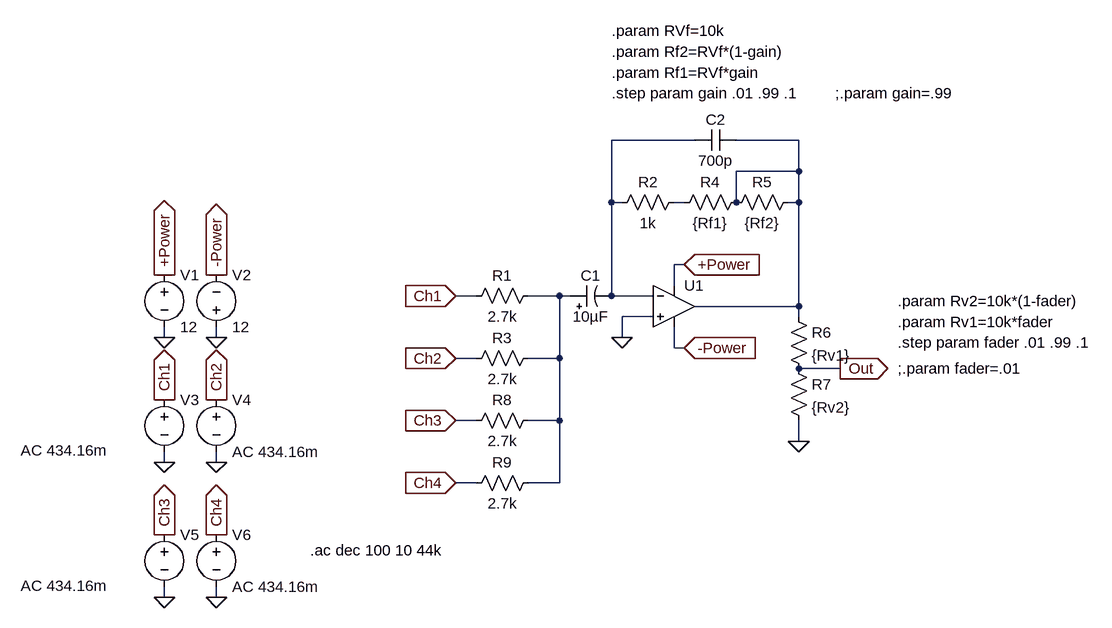
[diagram p0: schematic Master Mixer Freq.asc]
Master Mixer Freq.asc, the LTspice schematic file:
Version 4.1
SHEET 1 924 680
WIRE 256 -128 128 -128
WIRE 416 -128 320 -128
WIRE 416 -80 416 -128
WIRE 416 -80 320 -80
WIRE 128 -32 128 -128
WIRE 144 -32 128 -32
WIRE 240 -32 224 -32
WIRE 320 -32 320 -80
WIRE 416 -32 416 -80
WIRE 416 -32 400 -32
WIRE 240 64 224 64
WIRE 224 96 224 64
WIRE -80 112 -112 112
WIRE 48 112 0 112
WIRE 64 112 48 112
WIRE 128 112 128 -32
WIRE 192 112 128 112
WIRE 416 128 416 -32
WIRE 416 128 256 128
WIRE 192 144 144 144
WIRE 416 144 416 128
WIRE -560 176 -560 160
WIRE -480 176 -480 160
WIRE 144 176 144 144
WIRE 224 192 224 160
WIRE 240 192 224 192
WIRE -80 208 -112 208
WIRE 48 208 48 112
WIRE 48 208 0 208
WIRE 480 224 416 224
WIRE -80 304 -112 304
WIRE 48 304 48 208
WIRE 48 304 0 304
WIRE 416 336 416 304
WIRE -560 368 -560 352
WIRE -480 368 -480 352
WIRE -80 400 -112 400
WIRE 48 400 48 304
WIRE 48 400 0 400
WIRE -560 576 -560 560
WIRE -480 576 -480 560
FLAG 240 64 +Power
IOPIN 240 64 In
FLAG 240 192 -Power
IOPIN 240 192 In
FLAG 144 176 0
FLAG 416 336 0
FLAG -112 112 Ch1
IOPIN -112 112 In
FLAG -112 208 Ch2
IOPIN -112 208 In
FLAG 480 224 Out
IOPIN 480 224 Out
FLAG -560 80 +Power
IOPIN -560 80 Out
FLAG -560 176 0
FLAG -480 176 0
FLAG -560 368 0
FLAG -480 80 -Power
IOPIN -480 80 Out
FLAG -560 272 Ch1
IOPIN -560 272 Out
FLAG -480 368 0
FLAG -480 272 Ch2
IOPIN -480 272 Out
FLAG -112 304 Ch3
IOPIN -112 304 In
FLAG -112 400 Ch4
IOPIN -112 400 In
FLAG -560 576 0
FLAG -560 480 Ch3
IOPIN -560 480 Out
FLAG -480 576 0
FLAG -480 480 Ch4
IOPIN -480 480 Out
SYMBOL res 16 96 R90
WINDOW 0 0 56 VBottom 2
WINDOW 3 32 56 VTop 2
SYMATTR InstName R1
SYMATTR Value 2.7k
SYMBOL OpAmps\\UniversalOpAmp 224 128 R0
SYMATTR InstName U1
SYMBOL res 240 -48 R90
WINDOW 0 0 56 VBottom 2
WINDOW 3 32 56 VTop 2
SYMATTR InstName R2
SYMATTR Value 1k
SYMBOL res 16 192 R90
WINDOW 0 0 56 VBottom 2
WINDOW 3 32 56 VTop 2
SYMATTR InstName R3
SYMATTR Value 2.7k
SYMBOL voltage -560 64 R0
WINDOW 123 0 0 Left 0
WINDOW 39 0 0 Left 0
SYMATTR InstName V1
SYMATTR Value 12
SYMBOL voltage -480 176 M180
WINDOW 0 24 96 Left 2
WINDOW 3 24 16 Left 2
WINDOW 123 0 0 Left 0
WINDOW 39 0 0 Left 0
SYMATTR InstName V2
SYMATTR Value 12
SYMBOL voltage -560 256 R0
WINDOW 3 -221 94 Left 2
WINDOW 123 0 0 Left 0
WINDOW 39 0 0 Left 0
SYMATTR Value AC 434.16m
SYMATTR InstName V3
SYMBOL voltage -480 256 R0
WINDOW 123 0 0 Left 0
WINDOW 39 0 0 Left 0
SYMATTR InstName V4
SYMATTR Value AC 434.16m
SYMBOL res 336 -48 R90
WINDOW 0 0 56 VBottom 2
WINDOW 3 32 56 VTop 2
SYMATTR InstName R4
SYMATTR Value {Rf1}
SYMBOL res 416 -48 R90
WINDOW 0 0 56 VBottom 2
WINDOW 3 32 56 VTop 2
SYMATTR InstName R5
SYMATTR Value {Rf2}
SYMBOL res 400 128 R0
SYMATTR InstName R6
SYMATTR Value {Rv1}
SYMBOL res 400 208 R0
SYMATTR InstName R7
SYMATTR Value {Rv2}
SYMBOL res 16 288 R90
WINDOW 0 0 56 VBottom 2
WINDOW 3 32 56 VTop 2
SYMATTR InstName R8
SYMATTR Value 2.7k
SYMBOL res 16 384 R90
WINDOW 0 0 56 VBottom 2
WINDOW 3 32 56 VTop 2
SYMATTR InstName R9
SYMATTR Value 2.7k
SYMBOL voltage -560 464 R0
WINDOW 3 -221 94 Left 2
WINDOW 123 0 0 Left 0
WINDOW 39 0 0 Left 0
SYMATTR Value AC 434.16m
SYMATTR InstName V5
SYMBOL voltage -480 464 R0
WINDOW 123 0 0 Left 0
WINDOW 39 0 0 Left 0
SYMATTR InstName V6
SYMATTR Value AC 434.16m
SYMBOL polcap 64 128 R270
WINDOW 0 32 32 VTop 2
WINDOW 3 0 32 VBottom 2
SYMATTR InstName C1
SYMATTR Value 10µF
SYMBOL cap 320 -144 R90
WINDOW 0 0 32 VBottom 2
WINDOW 3 32 32 VTop 2
SYMATTR InstName C2
SYMATTR Value 700p
TEXT 128 -200 Left 2 !.step param gain .01 .99 .1
TEXT 568 184 Left 2 !.step param fader .01 .99 .1
TEXT 128 -232 Left 2 !.param Rf1=RVf*gain
TEXT 568 152 Left 2 !.param Rv1=10k*fader
TEXT 128 -264 Left 2 !.param Rf2=RVf*(1-gain)
TEXT 568 120 Left 2 !.param Rv2=10k*(1-fader)
TEXT 128 -296 Left 2 !.param RVf=10k
TEXT -336 504 Left 2 !.ac dec 100 10 44k
TEXT 472 -200 Left 2 !;.param gain=.99
TEXT 568 224 Left 2 !;.param fader=.01

The netlist it stands for:
* Master Mixer Freq.asc
R1 N004 Ch1 2.7k
X§U1 0 N001 +Power -Power N002 level1 Avol=1Meg GBW=10Meg Vos=0 En=0 Enk=0 In=0 Ink=0 Rin=500Meg  ; pins In+ In- V+ V- OUT
R2 N003 N001 1k
R3 N004 Ch2 2.7k
V1 +Power 0 12
V2 0 -Power 12
V3 Ch1 0 AC 434.16m
V4 Ch2 0 AC 434.16m
R4 N002 N003 {Rf1}
R5 N002 N002 {Rf2}
R6 N002 Out {Rv1}
R7 Out 0 {Rv2}
R8 N004 Ch3 2.7k
R9 N004 Ch4 2.7k
V5 Ch3 0 AC 434.16m
V6 Ch4 0 AC 434.16m
C1 N004 N001 10µF
C2 N002 N001 700p
.step param gain .01 .99 .1
.step param fader .01 .99 .1
.param Rf1=RVf*gain
.param Rv1=10k*fader
.param Rf2=RVf*(1-gain)
.param Rv2=10k*(1-fader)
.param RVf=10k
.ac dec 100 10 44k
;.param gain=.99
;.param fader=.01
.lib UniversalOpAmp1.lib
.backanno
.end